# EAGLE schematic main_top (EAGLE 9.6.2)
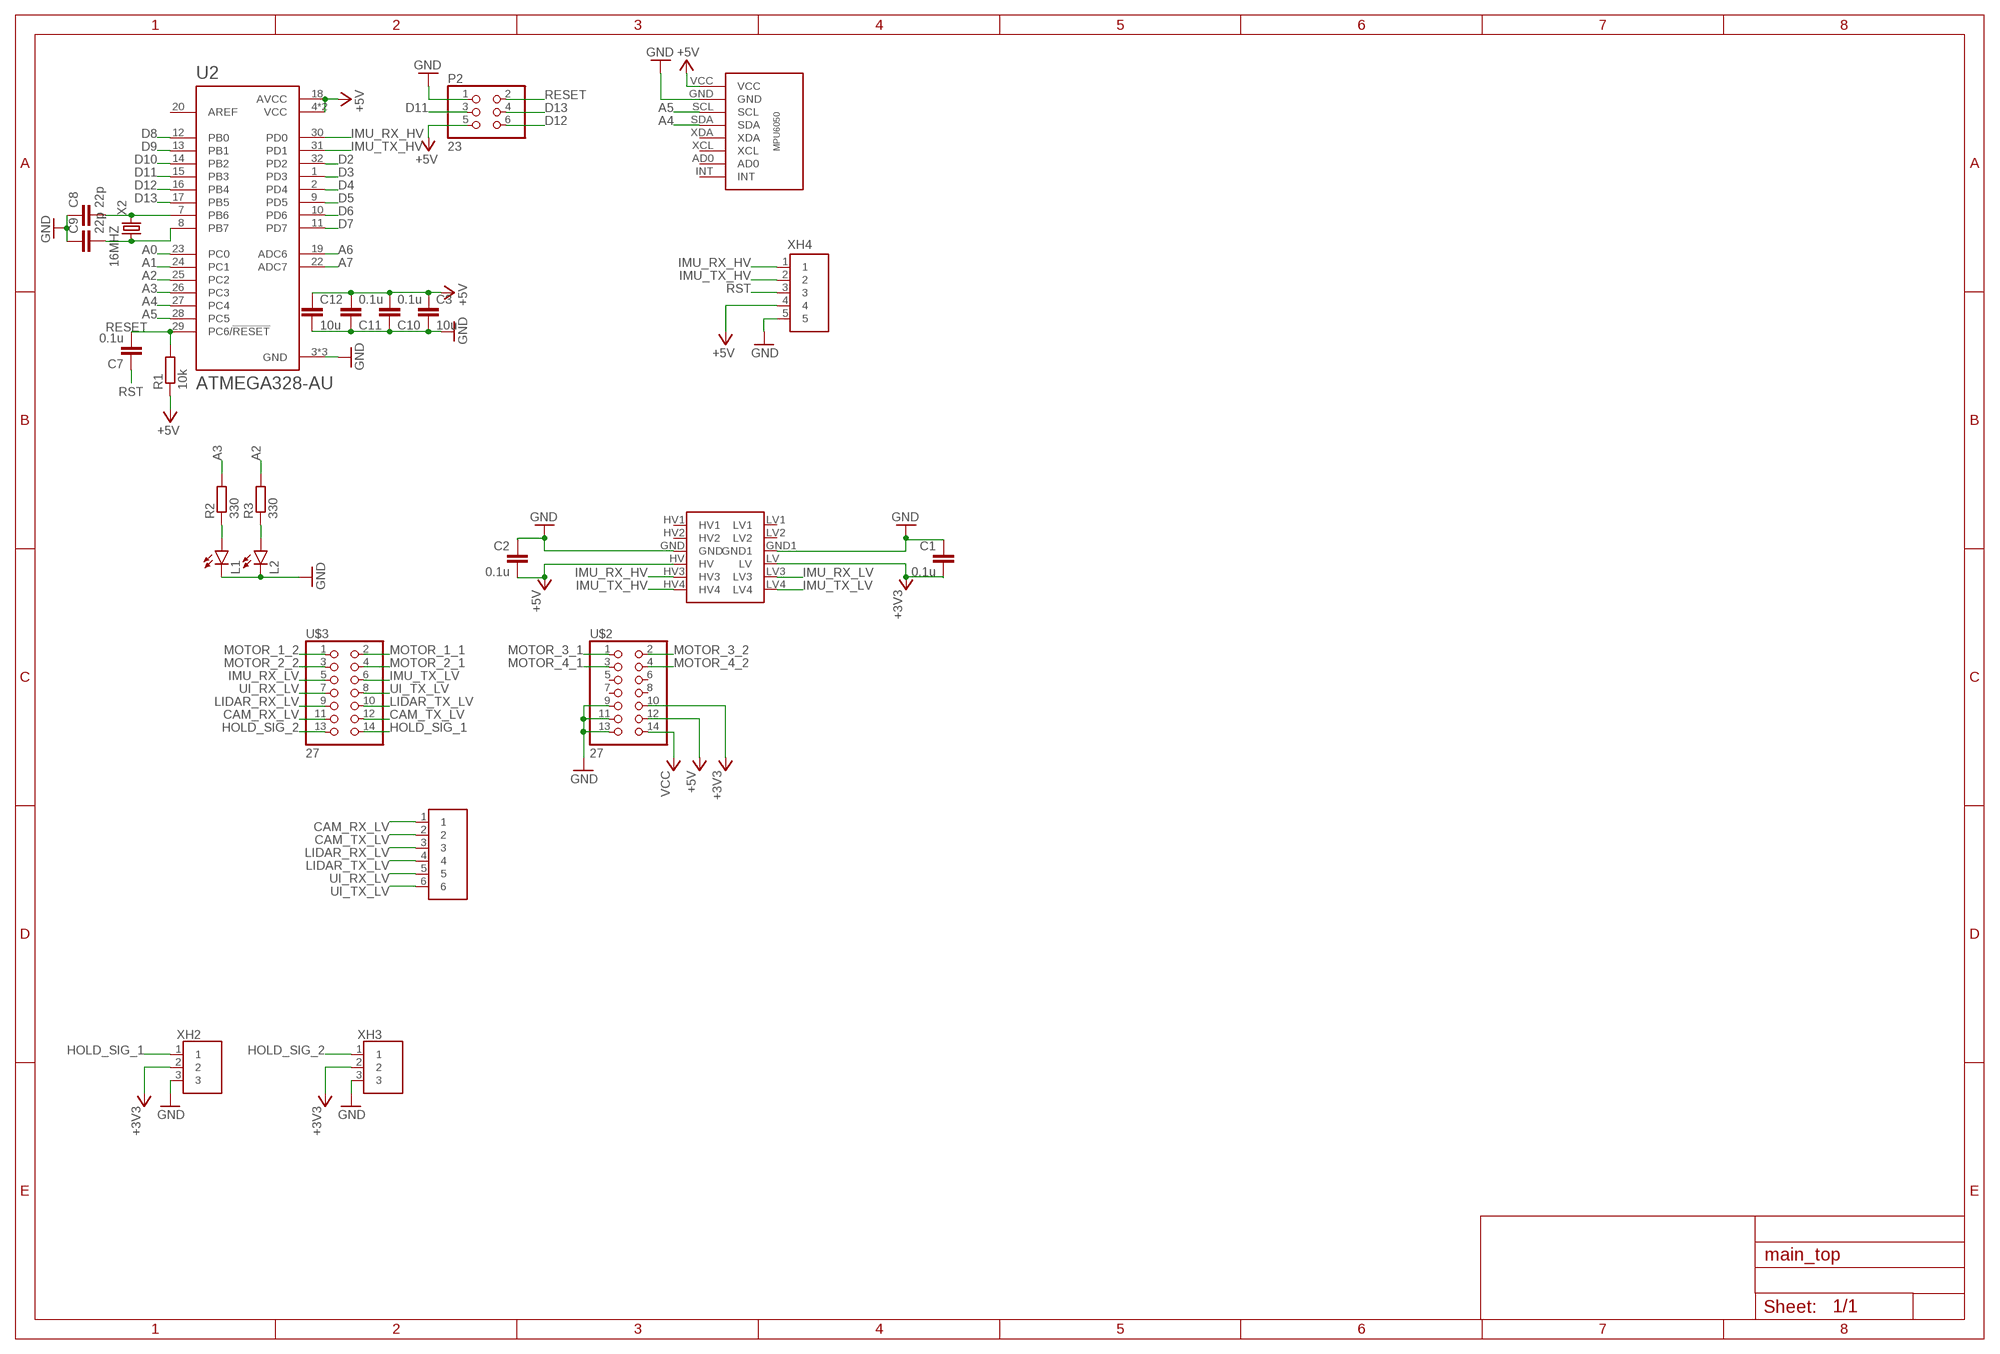
[diagram p0: schematic, sheet 1]

## Parts
C1  0.1u  C-EUC0603  [C0603]
C2  0.1u  C-EUC0603  [C0603]
C3  10u  C-EUC0805  [C0805]
C7  0.1u  C-EUC0603  [C0603]
C8  22p  C-EUC0603  [C0603]
C9  22p  C-EUC0603  [C0603]
C10  0.1u  C-EUC0603  [C0603]
C11  0.1u  C-EUC0603  [C0603]
C12  10u  C-EUC0805  [C0805]
L1  SML-E12P8WT86  [LED_SML-LXFM0603SIC-TR]
L2  SML-E12P8WT86  [LED_SML-LXFM0603SIC-TR]
P2  23  [2*3]
Q1  BSS138  [BSS138]
R1  10k  R-EU_0204/5  [0204/5]
R2  330  R-EU_0204/5  [0204/5]
R3  330  R-EU_0204/5  [0204/5]
U2  ATMEGA328-AU  [QFP80P900X900X120-32N]
U$1  MPU6050  [MPU6050]
U$2  27  [2*7]
U$3  27  [2*7]
X2  16MHZ  [16MHZ]
XH1  S6B  [S6B]
XH2  S3B  [S3B]
XH3  S3B  [S3B]
XH4  S5B  [S5B]

## Nets
+3V3: C1.2 Q1.LV U$2.10 XH2.2 XH3.2
+5V: C2.2 C3.1 C10.2 C11.2 C12.1 P2.5 Q1.HV R1.1 U2.4(VCC) U2.6(VCC) U2.18(AVCC) U$1.VCC U$2.12 XH4.4
A0: U2.23(PC0)
A1: U2.24(PC1)
A2: R3.2 U2.25(PC2)
A3: R2.2 U2.26(PC3)
A4: U2.27(PC4) U$1.SDA
A5: U2.28(PC5) U$1.SCL
A6: U2.19(ADC6)
A7: U2.22(ADC7)
CAM_RX_LV: U$3.11 XH1.1
CAM_TX_LV: U$3.12 XH1.2
D2: U2.32(PD2)
D3: U2.1(PD3)
D4: U2.2(PD4)
D5: U2.9(PD5)
D6: U2.10(PD6)
D7: U2.11(PD7)
D8: U2.12(PB0)
D9: U2.13(PB1)
D10: U2.14(PB2)
D11: P2.3 U2.15(PB3)
D12: P2.6 U2.16(PB4)
D13: P2.4 U2.17(PB5)
GND: C1.1 C2.1 C3.2 C8.1 C9.1 C10.1 C11.1 C12.2 L1.C L2.C P2.1 Q1.GND Q1.GND1 U2.3(GND) U2.5(GND) U2.21(GND) U$1.GND U$2.9 U$2.11 U$2.13 XH2.3 XH3.3 XH4.5
HOLD_SIG_1: U$3.14 XH2.1
HOLD_SIG_2: U$3.13 XH3.1
IMU_RX_HV: Q1.HV3 U2.30(PD0) XH4.1
IMU_RX_LV: Q1.LV3 U$3.5
IMU_TX_HV: Q1.HV4 U2.31(PD1) XH4.2
IMU_TX_LV: Q1.LV4 U$3.6
LIDAR_RX_LV: U$3.9 XH1.3
LIDAR_TX_LV: U$3.10 XH1.4
MOTOR_1_1: U$3.2
MOTOR_1_2: U$3.1
MOTOR_2_1: U$3.4
MOTOR_2_2: U$3.3
MOTOR_3_1: U$2.1
MOTOR_3_2: U$2.2
MOTOR_4_1: U$2.3
MOTOR_4_2: U$2.4
N$1: C8.2 U2.7(PB6) X2.P$2
N$2: C9.2 U2.8(PB7) X2.P$1
N$3: L1.A R2.1
N$8: L2.A R3.1
RESET: C7.2 P2.2 R1.2 U2.29(PC6/!RESET)
RST: C7.1 XH4.3
UI_RX_LV: U$3.7 XH1.5
UI_TX_LV: U$3.8 XH1.6
VCC: U$2.14
Unconnected: Q1.HV1 Q1.HV2 Q1.LV1 Q1.LV2 U2.20(AREF) U$1.AD0 U$1.INT U$1.XCL U$1.XDA U$2.5 U$2.6 U$2.7 U$2.8

## Library data of the parts
C1-C3 C7-C12 = rcl:C-EU: CAPACITOR, European symbol; SPICEPREFIX: C
L1 L2 = LED:SML-E12P8WT86
P2 = pin_socket:2*3
Q1 = logic_level:BSS138
R1-R3 = rcl:R-EU_: RESISTOR, European symbol; SPICEPREFIX: R
U2 = ATMEGA328-AU:ATMEGA328-AU: ATmega Series 20 MHz 32 KB Flash 2 KB SRAM 8-Bit Microcontroller - TQFP-32 Check availability <https://pricing.snapeda.com/parts/ATMEGA328-AU/Microchip/view-part?ref=eda>; AVAILABILITY: In Stock; DESCRIPTION: AVR AVR® ATmega Microcontroller IC 8-Bit 20MHz 32KB (16K x 16) FLASH 32-TQFP (7x7); MF: Microchip; MP: ATMEGA328-AU; PACKAGE: TQFP-32 Microchip; PRICE: None; PURCHASE-URL: https://pricing.snapeda.com/search/part/ATMEGA328-AU/?ref=eda
U$1 = MPU6050:MPU6050
U$2 U$3 = pin_socket:2*7
X2 = crystal:16MHZ
XH1 = XH:S6B
XH2 XH3 = XH:S3B
XH4 = XH:S5B